# EAGLE design mcp30008 (EAGLE 7.7.0)
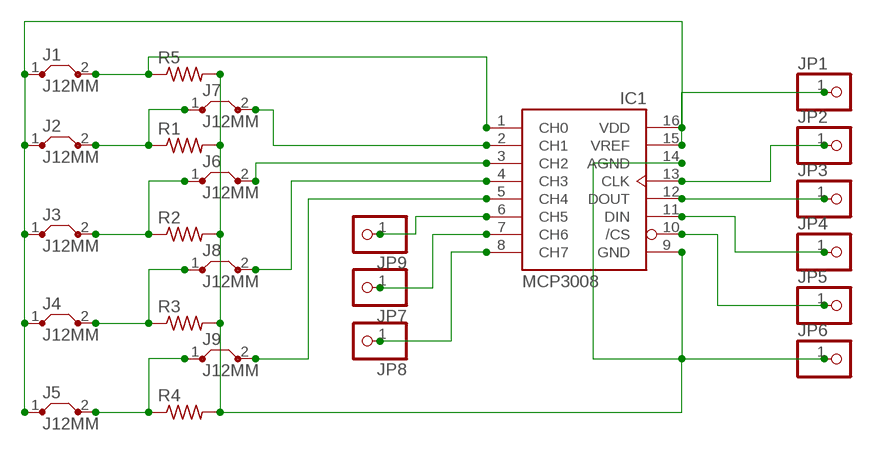
[diagram p0: schematic, sheet 1]

## Parts
IC1  MCP3008  [DIL16]
J1  J12MM  [12]
J2  J12MM  [12]
J3  J12MM  [12]
J4  J12MM  [12]
J5  J12MM  [12]
J6  J12MM  [12]
J7  J12MM  [12]
J8  J12MM  [12]
J9  J12MM  [12]
JP1  PINHD-1X1  [1X01]
JP2  PINHD-1X1  [1X01]
JP3  PINHD-1X1  [1X01]
JP4  PINHD-1X1  [1X01]
JP5  PINHD-1X1  [1X01]
JP6  PINHD-1X1  [1X01]
JP7  PINHD-1X1  [1X01]
JP8  PINHD-1X1  [1X01]
JP9  PINHD-1X1  [1X01]
R1  R-US_0207/15  [0207/15]
R2  R-US_0207/15  [0207/15]
R3  R-US_0207/15  [0207/15]
R4  R-US_0207/15  [0207/15]
R5  R-US_0207/15  [0207/15]

## Nets
N$1: IC1.6(CH5) JP9.1
N$3: IC1.1(CH0) J1.2 R5.1
N$4: IC1.13(CLK) JP2.1
N$5: IC1.12(DOUT) JP3.1
N$6: IC1.11(DIN) JP4.1
N$7: IC1.10(/CS) JP5.1
N$11: IC1.3(CH2) J6.2
N$12: IC1.4(CH3) J8.2
N$16: IC1.8(CH7) JP8.1
N$23: IC1.15(VREF) IC1.16(VDD) J1.1 J2.1 J3.1 J4.1 J5.1 JP1.1
N$27: J5.2 J9.1 R4.1
N$28: IC1.5(CH4) J9.2
N$30: J4.2 J8.1 R3.1
N$32: IC1.2(CH1) J7.2
N$33: J2.2 J7.1 R1.1
N$34: J3.2 J6.1 R2.1
N$40: IC1.9(GND) IC1.14(AGND) JP6.1 R1.2 R2.2 R3.2 R4.2 R5.2
N$44: IC1.7(CH6) JP7.1

## Library data of the parts
IC1 = adafruit2:MCP3008
J1-J9 = jumper2:J: Bridge
JP1-JP9 = pinhead2:PINHD-1X1: PIN HEADER
R1-R5 = resistor2:R-US_: RESISTOR, American symbol

## Board
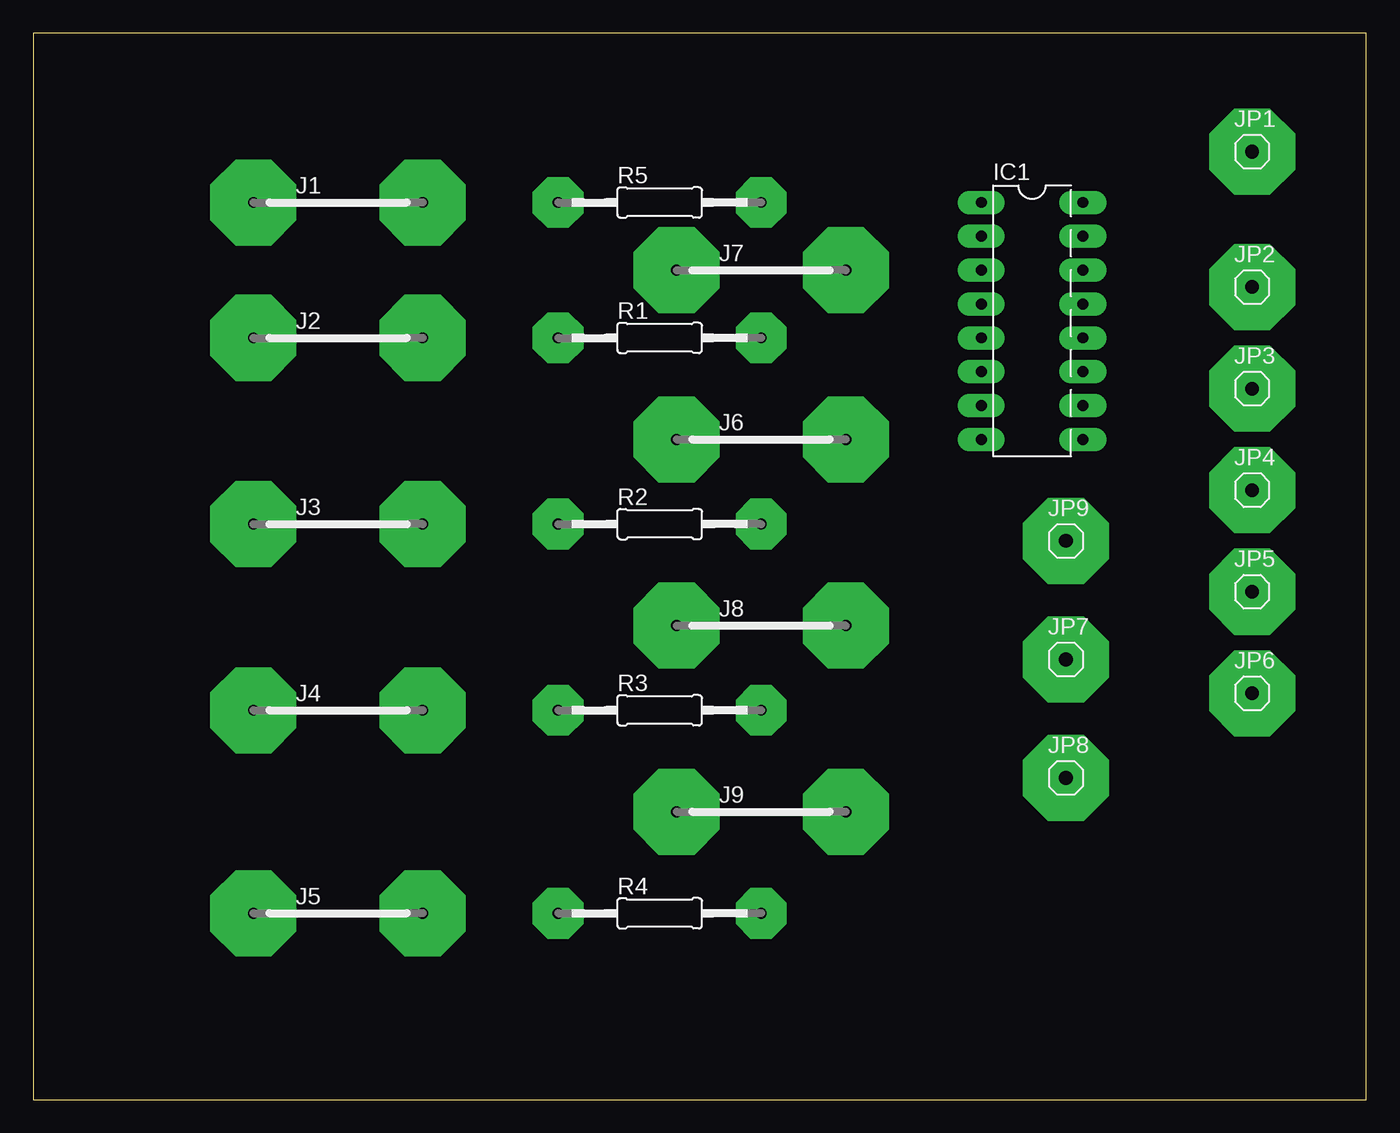
[diagram p1: board, top side]
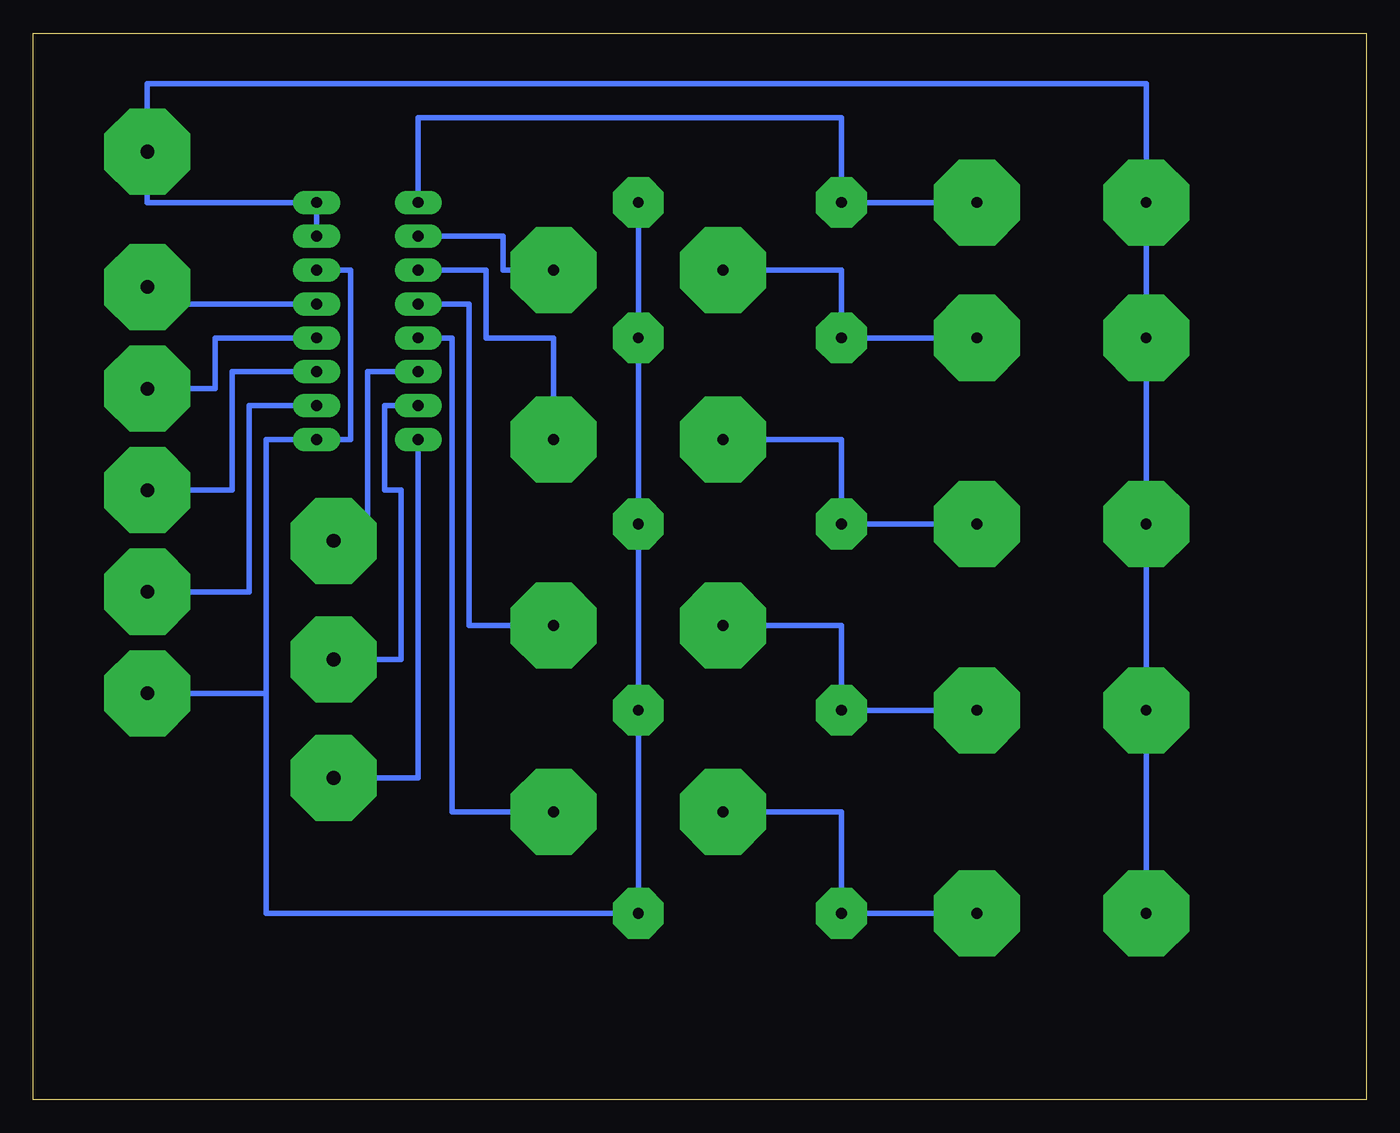
[diagram p2: board, bottom side, seen from below]

Size 100 x 80 mm. Coordinates in mm from the lower left corner, seen from the top.
Outline: 0,0 100,0 100,80 0,80 0,0
Copper layers (1*16): Top 0.035mm / dielectric 1.5mm / Bottom 0.035mm
Design rules "default": minimum track width 10mil, minimum drill 24mil, track to track 8mil, track to pad 8mil, pad to pad 8mil, via to via 8mil, smd to smd 8mil, copper to edge 40mil, drill to drill 8mil, minimum pad ring 10mil, minimum via ring 8mil, stop-mask expansion 4mil, vias tented up to drill 0mil, thermal gap 10mil

### Footprints (pad centres in the part's own frame; a part is rotated, then mirrored left to right if it is on the bottom)
DIL16 = drill 0.813 pad 1.778 long: 1 -8.89,-3.81; 2 -6.35,-3.81; 3 -3.81,-3.81; 4 -1.27,-3.81; 5 1.27,-3.81; 6 3.81,-3.81; 7 6.35,-3.81; 8 8.89,-3.81; 9 8.89,3.81; 10 6.35,3.81; 11 3.81,3.81; 12 1.27,3.81; 13 -1.27,3.81; 14 -3.81,3.81; 15 -6.35,3.81; 16 -8.89,3.81
12 = drill 0.813 pad 6.452 octagon: 1 -6.35,0; 2 6.35,0
1X01 = drill 1.016 pad 6.452 octagon: 1 0,0
0207/15 = drill 0.813 pad 3.81 octagon: 1 -7.62,0; 2 7.62,0

### Placement (x,y rotation side)
IC1  74.93,58.42 270 top
J1  22.86,67.31 0 top
J2  22.86,57.15 0 top
J3  22.86,43.18 0 top
J4  22.86,29.21 0 top
J5  22.86,13.97 0 top
J6  54.61,49.53 0 top
J7  54.61,62.23 0 top
J8  54.61,35.56 0 top
J9  54.61,21.59 0 top
JP1  91.44,71.12 0 top
JP2  91.44,60.96 0 top
JP3  91.44,53.34 0 top
JP4  91.44,45.72 0 top
JP5  91.44,38.1 0 top
JP6  91.44,30.48 0 top
JP7  77.47,33.02 0 top
JP8  77.47,24.13 0 top
JP9  77.47,41.91 0 top
R1  46.99,57.15 0 top
R2  46.99,43.18 0 top
R3  46.99,29.21 0 top
R4  46.99,13.97 0 top
R5  46.99,67.31 0 top

### Tracks (layer width: path | path; a pad name or v marks a point on that pad's centre or on a via)
N$1
  Bottom 0.406: IC1.6 74.93,54.61 74.93,41.91 JP9.1
N$3
  Bottom 0.406: J1.2 R5.1 39.37,73.66 71.12,73.66 IC1.1
N$4
  Bottom 0.406: JP2.1 91.44,59.69 IC1.13
N$5
  Bottom 0.406: JP3.1 86.36,53.34 86.36,57.15 IC1.12
N$6
  Bottom 0.406: IC1.11 85.09,54.61 85.09,45.72 JP4.1
N$7
  Bottom 0.406: JP5.1 83.82,38.1 83.82,52.07 IC1.10
N$11
  Bottom 0.406: J6.2 60.96,57.15 66.04,57.15 66.04,62.23 IC1.3
N$12
  Bottom 0.406: IC1.4 67.31,59.69 67.31,35.56 J8.2
N$16
  Bottom 0.406: IC1.8 71.12,24.13 JP8.1
N$23
  Bottom 0.406: IC1.15 IC1.16 91.44,67.31 JP1.1 91.44,76.2 16.51,76.2 J1.1 J2.1 J3.1 J4.1 J5.1
N$27
  Bottom 0.406: J5.2 R4.1 | J9.1 39.37,21.59 R4.1 | 39.37,12.7 R4.1
N$28
  Bottom 0.406: J9.2 68.58,21.59 68.58,57.15 IC1.5
N$30
  Bottom 0.406: J8.1 39.37,35.56 R3.1 J4.2
N$32
  Bottom 0.406: J7.2 64.77,62.23 64.77,64.77 IC1.2
N$33
  Bottom 0.406: J7.1 39.37,62.23 R1.1 J2.2
N$34
  Bottom 0.406: J3.2 R2.1 39.37,49.53 J6.1
N$40
  Bottom 0.406: R5.2 R1.2 R2.2 R3.2 R4.2 82.55,13.97 82.55,30.48 | 82.55,30.48 82.55,49.53 IC1.9 76.2,49.53 76.2,62.23 IC1.14 | 82.55,30.48 JP6.1
N$44
  Bottom 0.406: IC1.7 73.66,52.07 73.66,45.72 72.39,45.72 72.39,33.02 JP7.1